# EAGLE design vdmotCtrl_v1 (EAGLE 9.5.2)
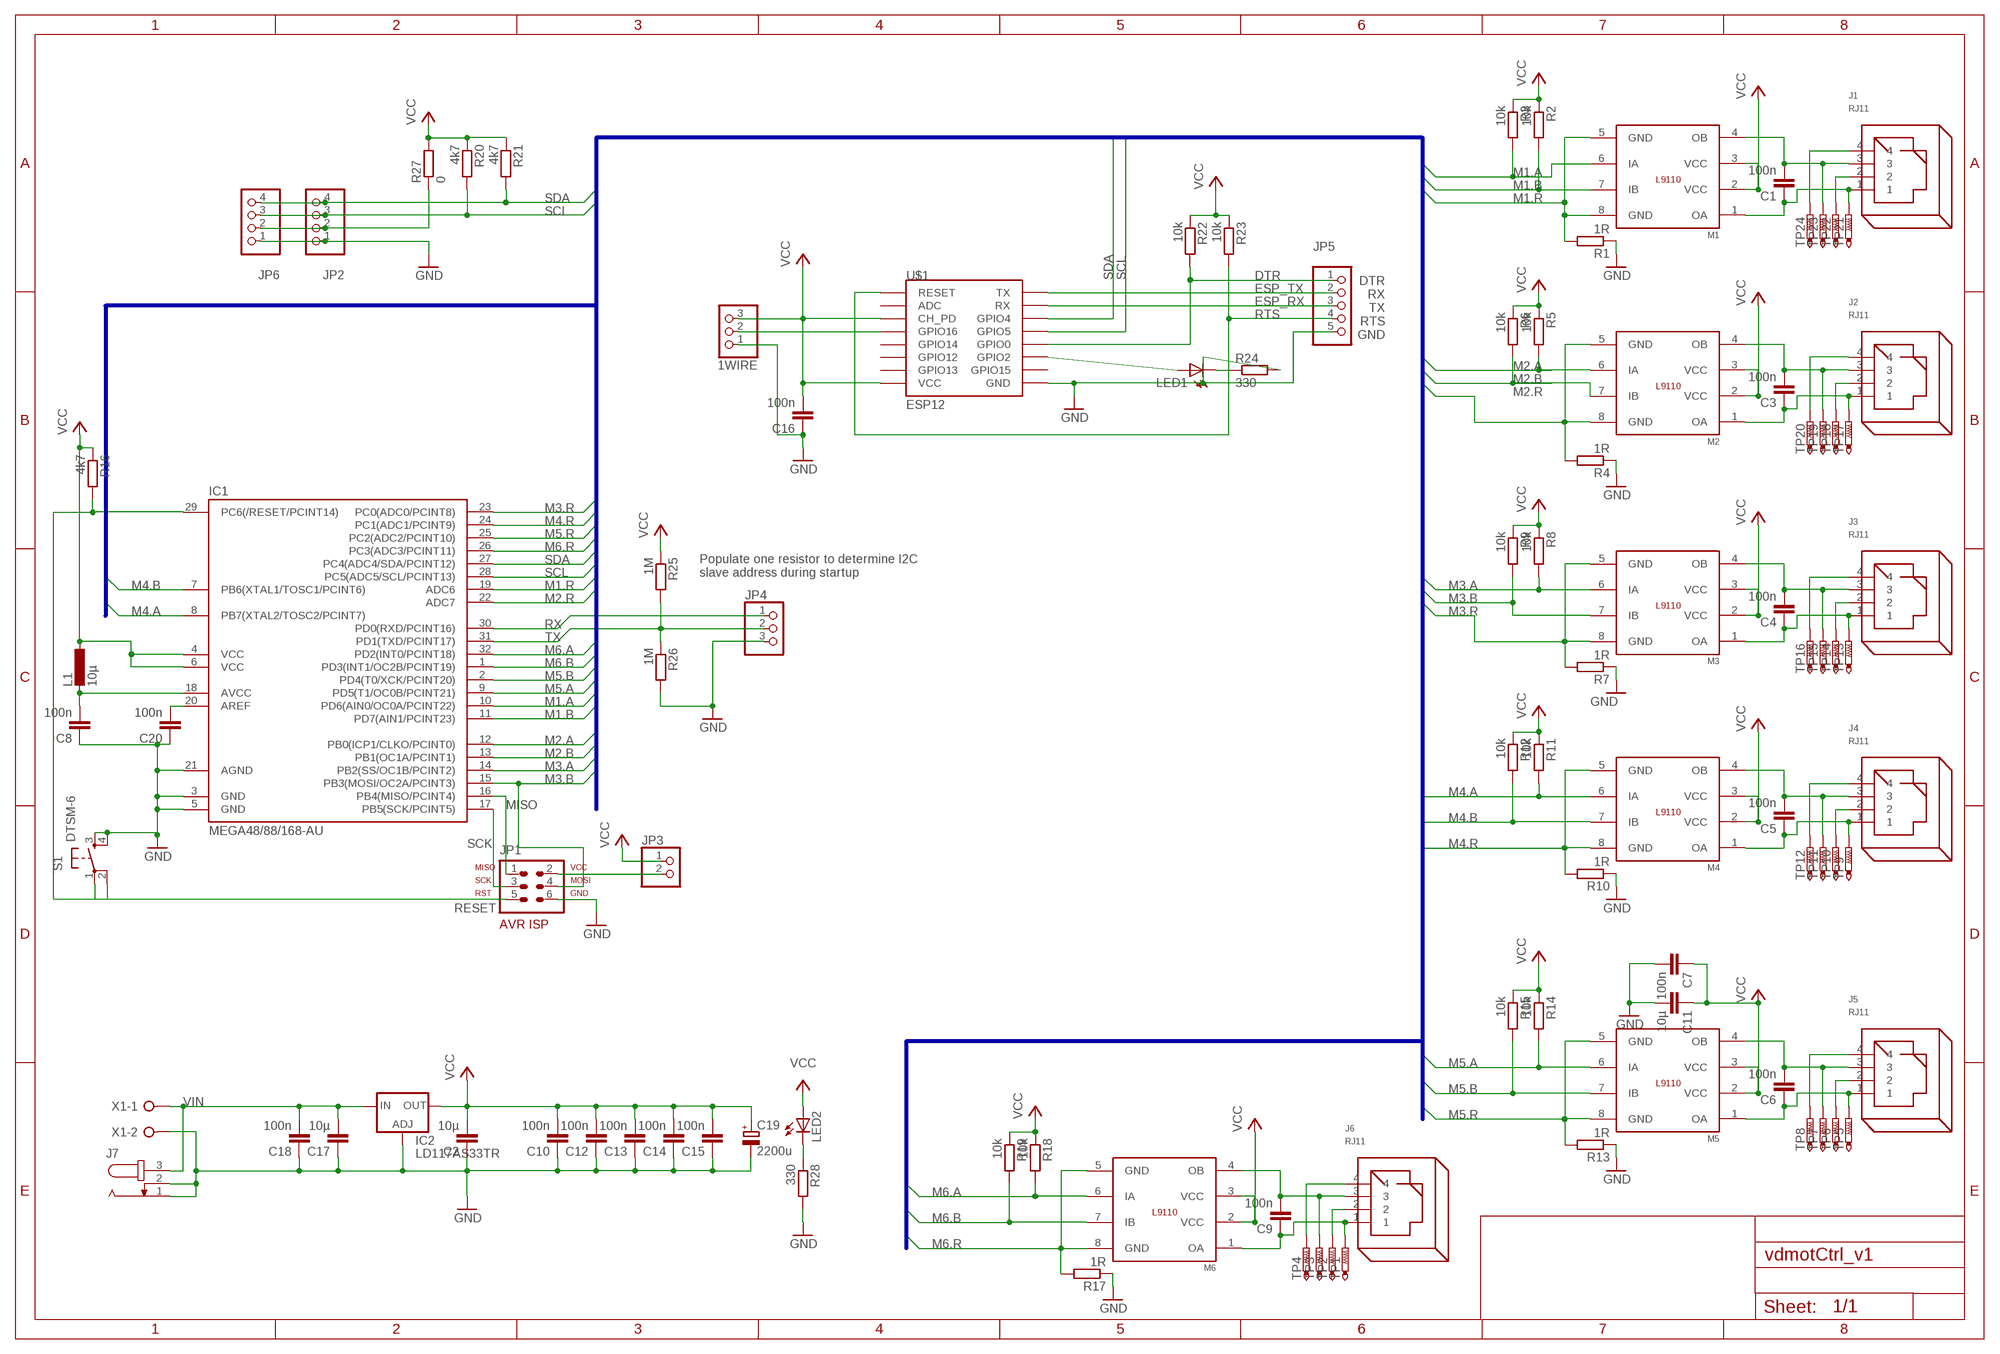
[diagram p0: schematic, sheet 1]

## Parts
1WIRE  PINHD-1X3  [1X03]
C1  100n  C-EUC0805  [C0805]
C2  10µ  C-EUC0805  [C0805]
C3  100n  C-EUC0805  [C0805]
C4  100n  C-EUC0805  [C0805]
C5  100n  C-EUC0805  [C0805]
C6  100n  C-EUC0805  [C0805]
C7  100n  C-EUC0805  [C0805]
C8  100n  C-EUC0805  [C0805]
C9  100n  C-EUC0805  [C0805]
C10  100n  C-EUC0805  [C0805]
C11  10µ  C-EUC0805  [C0805]
C12  100n  C-EUC0805  [C0805]
C13  100n  C-EUC0805  [C0805]
C14  100n  C-EUC0805  [C0805]
C15  100n  C-EUC0805  [C0805]
C16  100n  C-EUC0805  [C0805]
C17  10µ  C-EUC0805  [C0805]
C18  100n  C-EUC0805  [C0805]
C19  2200u  CPOL-EUE5-10.5  [E5-10,5]
C20  100n  C-EUC0805  [C0805]
IC1  MEGA48/88/168-AU  [TQFP32-08]
IC2  LD117AS33TR  [SOT223]
J1  RJ11  [RJ11]
J2  RJ11  [RJ11]
J3  RJ11  [RJ11]
J4  RJ11  [RJ11]
J5  RJ11  [RJ11]
J6  RJ11  [RJ11]
J7  JACK-PLUG0  [SPC4077]
JP1  AVR-ISP-6VERT  [AVR-ISP-6]
JP2  PINHD-1X4  [1X04]
JP3  PINHD-1X2  [1X02]
JP4  PINHD-1X3  [1X03]
JP5  PINHD-1X5  [1X05]
JP6  PINHD-1X4  [1X04]
L1  10µ  L-EU0204/7  [0204/7]
LED1  RED  LEDSML0805  [SML0805]
LED2  RED  LEDSML0805  [SML0805]
M1  L9110  [SO8P]
M2  L9110  [SO8P]
M3  L9110  [SO8P]
M4  L9110  [SO8P]
M5  L9110  [SO8P]
M6  L9110  [SO8P]
R1  1R  R-EU_R0805  [R0805]
R2  10k  R-EU_R0805  [R0805]
R3  10k  R-EU_R0805  [R0805]
R4  1R  R-EU_R0805  [R0805]
R5  10k  R-EU_R0805  [R0805]
R6  10k  R-EU_R0805  [R0805]
R7  1R  R-EU_R0805  [R0805]
R8  10k  R-EU_R0805  [R0805]
R9  10k  R-EU_R0805  [R0805]
R10  1R  R-EU_R0805  [R0805]
R11  10k  R-EU_R0805  [R0805]
R12  10k  R-EU_R0805  [R0805]
R13  1R  R-EU_R0805  [R0805]
R14  10k  R-EU_R0805  [R0805]
R15  10k  R-EU_R0805  [R0805]
R16  4k7  R-EU_R0805  [R0805]
R17  1R  R-EU_R0805  [R0805]
R18  10k  R-EU_R0805  [R0805]
R19  10k  R-EU_R0805  [R0805]
R20  4k7  R-EU_R0805  [R0805]
R21  4k7  R-EU_R0805  [R0805]
R22  10k  R-EU_R0805  [R0805]
R23  10k  R-EU_R0805  [R0805]
R24  330  R-EU_R0805  [R0805]
R25  1M  R-EU_R0805  [R0805]
R26  1M  R-EU_R0805  [R0805]
R27  0  R-EU_M0805  [M0805]
R28  330  R-EU_R0805  [R0805]
S1  DTSM-6  [DTSM-6]
TP1  PTR1TP15SQ  [TP15SQ]
TP2  PTR1TP15SQ  [TP15SQ]
TP3  PTR1TP15SQ  [TP15SQ]
TP4  PTR1TP15SQ  [TP15SQ]
TP5  PTR1TP15SQ  [TP15SQ]
TP6  PTR1TP15SQ  [TP15SQ]
TP7  PTR1TP15SQ  [TP15SQ]
TP8  PTR1TP15SQ  [TP15SQ]
TP9  PTR1TP15SQ  [TP15SQ]
TP10  PTR1TP15SQ  [TP15SQ]
TP11  PTR1TP15SQ  [TP15SQ]
TP12  PTR1TP15SQ  [TP15SQ]
TP13  PTR1TP15SQ  [TP15SQ]
TP14  PTR1TP15SQ  [TP15SQ]
TP15  PTR1TP15SQ  [TP15SQ]
TP16  PTR1TP15SQ  [TP15SQ]
TP17  PTR1TP15SQ  [TP15SQ]
TP18  PTR1TP15SQ  [TP15SQ]
TP19  PTR1TP15SQ  [TP15SQ]
TP20  PTR1TP15SQ  [TP15SQ]
TP21  PTR1TP15SQ  [TP15SQ]
TP22  PTR1TP15SQ  [TP15SQ]
TP23  PTR1TP15SQ  [TP15SQ]
TP24  PTR1TP15SQ  [TP15SQ]
U$1  ESP12  [ESP12]
X1  W237-02P  [W237-132]

## Nets
DTR: JP5.1 R22.2 U$1.GPIO0
ESP_RX: JP5.3 U$1.RX
ESP_TX: JP5.2 U$1.TX
GND: 1WIRE.1 C2.1 C7.2 C8.1 C10.1 C11.2 C12.1 C13.1 C14.1 C15.1 C16.1 C17.1 C18.1 C19.- C20.1 IC1.3(GND) IC1.5(GND) IC1.21(AGND) IC2.1(ADJ) J7.1 J7.2 JP1.6 JP2.1 JP4.3 JP5.5 JP6.1 R1.1 R4.1 R7.1 R10.1 R13.1 R17.1 R24.2 R26.2 R28.2 S1.3 S1.4 U$1.GND X1.2
M1.A: IC1.10(PD6(AIN0/OC0A/PCINT22)) M1.6(IA) R3.2
M1.B: IC1.11(PD7(AIN1/PCINT23)) M1.7(IB) R2.2
M1.R: IC1.19(ADC6) M1.5(GND) M1.8(GND) R1.2
M2.A: IC1.12(PB0(ICP1/CLKO/PCINT0)) M2.6(IA) R5.2
M2.B: IC1.13(PB1(OC1A/PCINT1)) M2.7(IB) R6.2
M2.R: IC1.22(ADC7) M2.5(GND) M2.8(GND) R4.2
M3.A: IC1.14(PB2(SS/OC1B/PCINT2)) M3.6(IA) R8.2
M3.B: IC1.15(PB3(MOSI/OC2A/PCINT3)) JP1.4 M3.7(IB) R9.2
M3.R: IC1.23(PC0(ADC0/PCINT8)) M3.5(GND) M3.8(GND) R7.2
M4.A: IC1.8(PB7(XTAL2/TOSC2/PCINT7)) M4.6(IA) R11.2
M4.B: IC1.7(PB6(XTAL1/TOSC1/PCINT6)) M4.7(IB) R12.2
M4.R: IC1.24(PC1(ADC1/PCINT9)) M4.5(GND) M4.8(GND) R10.2
M5.A: IC1.9(PD5(T1/OC0B/PCINT21)) M5.6(IA) R14.2
M5.B: IC1.2(PD4(T0/XCK/PCINT20)) M5.7(IB) R15.2
M5.R: IC1.25(PC2(ADC2/PCINT10)) M5.5(GND) M5.8(GND) R13.2
M6.A: IC1.32(PD2(INT0/PCINT18)) M6.6(IA) R18.2
M6.B: IC1.1(PD3(INT1/OC2B/PCINT19)) M6.7(IB) R19.2
M6.R: IC1.26(PC3(ADC3/PCINT11)) M6.5(GND) M6.8(GND) R17.2
MISO: IC1.16(PB4(MISO/PCINT4)) JP1.1
N$1: C1.1 J1.1 M1.1(OA) TP21.TP
N$2: C1.2 J1.3 M1.4(OB) TP23.TP
N$3: C3.1 J2.1 M2.1(OA) TP17.TP
N$4: C3.2 J2.3 M2.4(OB) TP19.TP
N$5: C4.1 J3.1 M3.1(OA) TP13.TP
N$6: C4.2 J3.3 M3.4(OB) TP15.TP
N$7: C5.1 J4.1 M4.1(OA) TP9.TP
N$8: C5.2 J4.3 M4.4(OB) TP11.TP
N$9: C6.1 J5.1 M5.1(OA) TP5.TP
N$10: C6.2 J5.3 M5.4(OB) TP7.TP
N$11: C20.2 IC1.20(AREF)
N$12: C8.2 IC1.18(AVCC) L1.2
N$13: J6.2 TP2.TP
N$14: LED1.A U$1.GPIO2
N$15: C9.1 J6.1 M6.1(OA) TP1.TP
N$16: C9.2 J6.3 M6.4(OB) TP3.TP
N$17: LED1.C R24.1
N$18: J6.4 TP4.TP
N$19: J1.2 TP22.TP
N$20: J1.4 TP24.TP
N$21: JP1.2 JP3.2
N$22: J2.2 TP18.TP
N$23: J2.4 TP20.TP
N$24: J3.4 TP16.TP
N$25: J3.2 TP14.TP
N$26: J4.4 TP12.TP
N$27: J4.2 TP10.TP
N$28: J5.4 TP8.TP
N$29: J5.2 TP6.TP
N$30: JP2.2 JP6.2 R27.1
N$31: 1WIRE.2 U$1.GPIO16
N$32: LED2.C R28.1
RESET: IC1.29(PC6(/RESET/PCINT14)) JP1.5 R16.2 S1.1 S1.2
RTS: JP5.4 R23.2 U$1.RESET
RX: IC1.30(PD0(RXD/PCINT16)) JP4.1
SCK: IC1.17(PB5(SCK/PCINT5)) JP1.3
SCL: IC1.28(PC5(ADC5/SCL/PCINT13)) JP2.3 JP6.3 R20.2 U$1.GPIO5
SDA: IC1.27(PC4(ADC4/SDA/PCINT12)) JP2.4 JP6.4 R21.2 U$1.GPIO4
TX: IC1.31(PD1(TXD/PCINT17)) JP4.2 R25.2 R26.1
VCC: 1WIRE.3 C2.2 C7.1 C10.2 C11.1 C12.2 C13.2 C14.2 C15.2 C16.2 C19.+ IC1.4(VCC) IC1.6(VCC) IC2.4(OUT) JP3.1 L1.1 LED2.A M1.2(VCC) M1.3(VCC) M2.2(VCC) M2.3(VCC) M3.2(VCC) M3.3(VCC) M4.2(VCC) M4.3(VCC) M5.2(VCC) M5.3(VCC) M6.2(VCC) M6.3(VCC) R2.1 R3.1 R5.1 R6.1 R8.1 R9.1 R11.1 R12.1 R14.1 R15.1 R16.1 R18.1 R19.1 R20.1 R21.1 R22.1 R23.1 R25.1 R27.2 U$1.CH_PD U$1.VCC
VIN: C17.2 C18.2 IC2.3(IN) J7.3 X1.1
Unconnected: U$1.ADC U$1.GPIO12 U$1.GPIO13 U$1.GPIO14 U$1.GPIO15

## Buses
M1.A,M1.B,M1.R,M2.A,M2.B,M2.R,M3.A,M3.B,M3.R,M4.A,M4.B,M4.R,M5.A,M5.B,M5.R,M6.A,M6.B,M6.R,SCL,SDA

## Notes on the sheet
- DTR
  RX
  TX
  RTS
  GND
- Populate one resistor to determine I2C
  slave address during startup

## Library data of the parts
1WIRE JP4 = pinhead:PINHD-1X3: PIN HEADER
C1-C18 C20 = rcl:C-EU: CAPACITOR, European symbol; SPICEPREFIX: C
C19 = rcl:CPOL-EU: POLARIZED CAPACITOR, European symbol; SPICEPREFIX: C
IC1 = avr-7:MEGA48/88/168
IC2 = v-reg:LD117A?*: Low drop fixed and adjustable positive voltage regulators 1 A Source: http://www.st.com/stonline/products/literature/ds/7194/ld1117axx.pdf
J1-J6 = con-rj:RJ11: RJ11, RJ22 RJ11 and RJ22 jacks side mounted http://www.tycoelectronics.com
J7 = con-jack:JACK-PLUG: DC POWER JACK Power Jack, DC, Right Angle, Through Hole, Rated 5A at 16VDC, PC Terminals Distributor: Farnell (www.Farnell.de) Drawing: 84N1161.pdf / 84N1162.pdf Manufacturer: SPC Technology (www.spctechnology.com) Type: SPC4077 / SPC 4078; OC_FARNELL: unknown; OC_NEWARK: unknown
JP1 = avr-7:AVR-ISP-6: AVR ISP-6 Serial Programming Header
JP2 JP6 = pinhead:PINHD-1X4: PIN HEADER
JP3 = pinhead:PINHD-1X2: PIN HEADER
JP5 = pinhead:PINHD-1X5: PIN HEADER
L1 = rcl:L-EU: INDUCTOR, European symbol; SPICEPREFIX: L
LED1 LED2 = led:LED: LED OSRAM: - CHIPLED LG R971, LG N971, LY N971, LG Q971, LY Q971, LO R971, LY R971 LH N974, LH R974 LS Q976, LO Q976, LY Q976 LO Q996 - Hyper CHIPLED LW Q18S LB Q993, LB Q99A, LB R99A - SideLED LS A670, LO A670, LY A670, LG A670, LP A670 LB A673, LV A673, LT A673, LW A673 LH A674 LY A675 LS A676, LA A676, LO A676, LY A676, LW A676 LS A679, LY A679, LG A679 - Hyper Micro SIDELED® LS Y876, LA Y876, LO Y876, LY Y876 LT Y87S - SmartLED LW L88C, LW L88S LB L89C, LB L89S, LG L890 LS L89K, LO L89K, LY L89K LS L896, LA L896, LO L896, LY L896 - TOPLED LS T670, LO T670, LY T670, LG T670, LP T670 LSG T670, LSP T670, LSY T670, LOP T670, LYG T670 LG T671, LOG T671, LSG T671 LB T673, LV T673, LT T673, LW T673 LH T674 LS T676, LA T676, LO T676, LY T676, LB T676, LH T676, LSB T676, LW T676 LB T67C, LV T67C, LT T67C, LS T67K, LO T67K, LY T67K, LW E67C LS E67B, LA E67B, LO E67B, LY E67B, LB E67C, LV E67C, LT E67C LW T67C LS T679, LY T679, LG T679 LS T770, LO T770, LY T770, LG T770, LP T770 LB T773, LV T773, LT T773, LW T773 LH T774 LS E675, LA E675, LY E675, LS T675 LS T776, LA T776, LO T776, LY T776, LB T776 LHGB T686 LT T68C, LB T68C - Hyper Mini TOPLED® LB M676 - Mini TOPLED Santana® LG M470 LS M47K, LO M47K, LY M47K Source: http://www.osram.convergy.de LUXEON: - LUMILED® LXK2-PW12-R00, LXK2-PW12-S00, LXK2-PW14-U00, LXK2-PW14-V00 LXK2-PM12-R00, LXK2-PM12-S00, LXK2-PM14-U00 LXK2-PE12-Q00, LXK2-PE12-R00, LXK2-PE12-S00, LXK2-PE14-T00, LXK2-PE14-U00 LXK2-PB12-K00, LXK2-PB12-L00, LXK2-PB12-M00, LXK2-PB14-N00, LXK2-PB14-P00, LXK2-PB14-Q00 LXK2-PR12-L00, LXK2-PR12-M00, LXK2-PR14-Q00, LXK2-PR14-R00 LXK2-PD12-Q00, LXK2-PD12-R00, LXK2-PD12-S00 LXK2-PH12-R00, LXK2-PH12-S00 LXK2-PL12-P00, LXK2-PL12-Q00, LXK2-PL12-R00 Source: www.luxeon.com KINGBRIGHT: KA-3528ASYC Source: www.kingbright.com
M1-M6 = FaBo-Motor:L9110
R1-R28 = rcl:R-EU_: RESISTOR, European symbol; SPICEPREFIX: R
S1 = switch-tact:DTSM-6
TP1-TP24 = testpad:PTR1: TEST PIN
U$1 = esp8266modules:ESP12: ESP8266 Wifi module 12
X1 = con-wago-508:W237-02P: WAGO SREW CLAMP; OC_FARNELL: unknown; OC_NEWARK: unknown

## Board
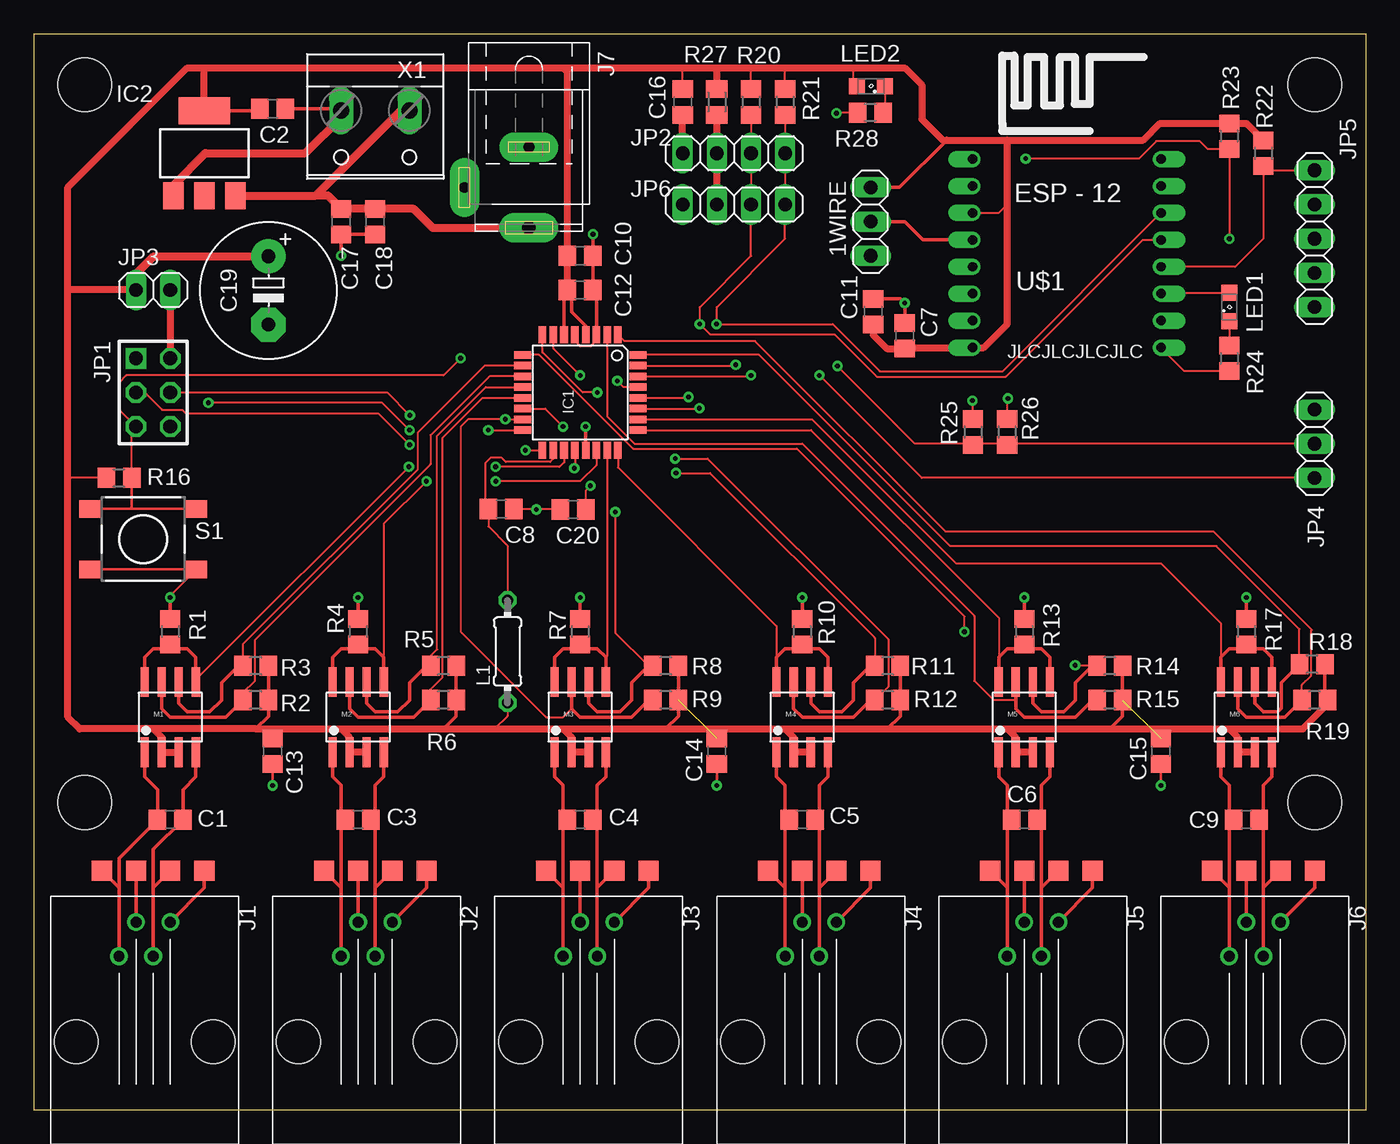
[diagram p1: board, top side]
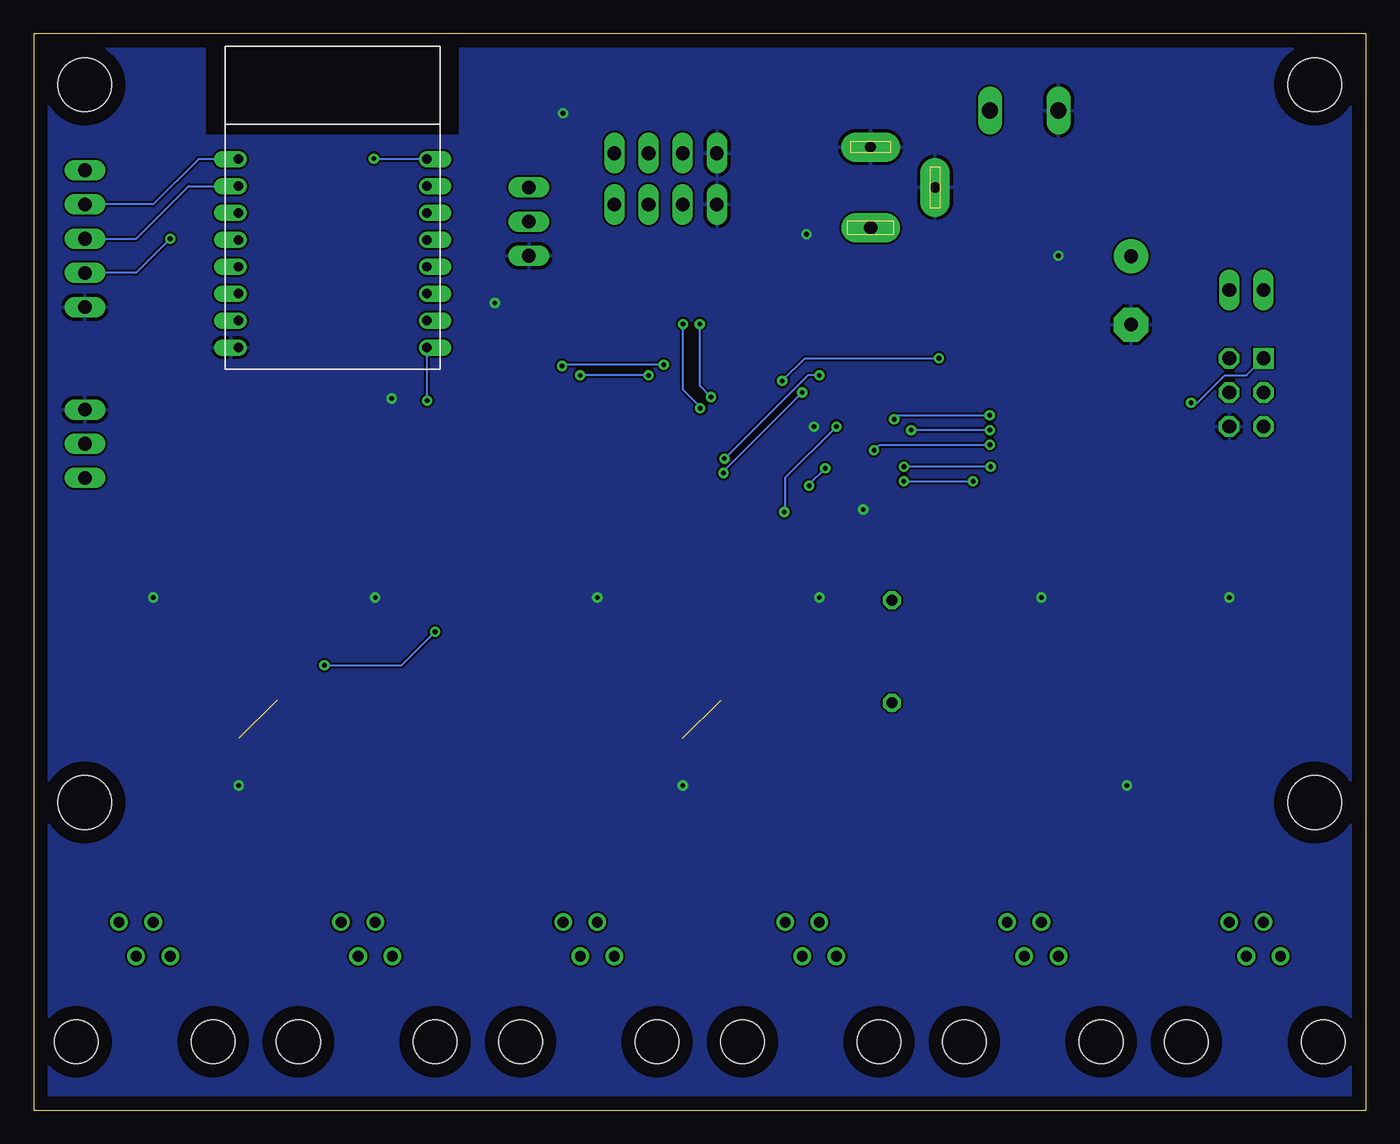
[diagram p2: board, bottom side, seen from below]

Size 99.06 x 80.01 mm. Coordinates in mm from the lower left corner, seen from the top.
Outline: 0,80 0,0 99.06,0 99.06,80.01 0,80.01
Copper layers (1*16): Top 0.035mm / dielectric 1.5mm / Bottom 0.035mm
Design rules "default": minimum track width 6mil, minimum drill 0.35mm, track to track 6mil, track to pad 6mil, pad to pad 6mil, via to via 6mil, smd to smd 6mil, copper to edge 40mil, drill to drill 6mil, minimum pad ring 10mil, minimum via ring 8mil, stop-mask expansion 4mil, vias tented up to drill 0mil, thermal gap 10mil
Holes 4 mm at 95.25,22.86 95.25,76.2 3.81,76.2 3.81,22.86

### Footprints (pad centres in the part's own frame; a part is rotated, then mirrored left to right if it is on the bottom)
1X03 = drill 1.016 long: 1 -2.54,0; 2 0,0; 3 2.54,0
C0805 = smd 1.3 x 1.5: 1 -0.95,0; 2 0.95,0
E5-10,5 = drill 1.016 pad 2.54: + -2.54,0 | drill 1.016 pad 2.54 octagon: - 2.54,0
TQFP32-08 = smd 1.27 x 0.559: 1 -4.293,2.8; 2 -4.293,2; 3 -4.293,1.2; 4 -4.293,0.4; 5 -4.293,-0.4; 6 -4.293,-1.2; 7 -4.293,-2; 8 -4.293,-2.8; 17 4.293,-2.8; 18 4.293,-2; 19 4.293,-1.2; 20 4.293,-0.4; 21 4.293,0.4; 22 4.293,1.2; 23 4.293,2; 24 4.293,2.8 | smd 0.559 x 1.27: 9 -2.8,-4.293; 10 -2,-4.293; 11 -1.2,-4.293; 12 -0.4,-4.293; 13 0.4,-4.293; 14 1.2,-4.293; 15 2,-4.293; 16 2.8,-4.293; 25 2.8,4.293; 26 2,4.293; 27 1.2,4.293; 28 0.4,4.293; 29 -0.4,4.293; 30 -1.2,4.293; 31 -2,4.293; 32 -2.8,4.293
SOT223 = smd 1.5 x 2: 1 -2.3,-3.15; 2 0,-3.15; 3 2.3,-3.15 | smd 3.8 x 2: 4 0,3.15
RJ11 = drill 0.8: 1 -3.81,-2.54; 2 -6.35,-1.27; 3 -3.81,0; 4 -6.35,1.27 | hole 3.25: 2.54,-5.715; 2.54,4.445
SPC4077 = drill 0.8 pad 2.184 long: 1 -3,0; 2 0,-4.8 | drill 1 pad 2.184 long: 3 3,0
AVR-ISP-6 = drill 1.016 square: 1 -2.54,-1.27 | drill 1.016 octagon: 2 -2.54,1.27; 3 0,-1.27; 4 0,1.27; 5 2.54,-1.27; 6 2.54,1.27
1X04 = drill 1.016 long: 1 -3.81,0; 2 -1.27,0; 3 1.27,0; 4 3.81,0
1X02 = drill 1.016 long: 1 -1.27,0; 2 1.27,0
1X05 = drill 1.016 long: 1 -5.08,0; 2 -2.54,0; 3 0,0; 4 2.54,0; 5 5.08,0
0204/7 = drill 0.813 octagon: 1 -3.81,0; 2 3.81,0
SML0805 = smd 1.2 x 1.2: A 1.05,0; C -1.05,0
SO8P = smd 0.61 x 2.21: 1 -1.905,-2.616; 2 -0.635,-2.616; 3 0.635,-2.616; 4 1.905,-2.616; 5 1.905,2.616; 6 0.635,2.616; 7 -0.635,2.616; 8 -1.905,2.616
R0805 = smd 1.3 x 1.5: 1 -0.95,0; 2 0.95,0
M0805 = smd 1.3 x 1.6: 1 -0.95,0; 2 0.95,0
DTSM-6 = smd 1.55 x 1.3: 1 -3.975,2.25; 2 3.975,2.25; 3 -3.975,-2.25; 4 3.975,-2.25
TP15SQ = smd 1.5 x 1.5: TP 0,0
ESP12 = drill 0.7 offset: ADC -7.1,3.8; CH_PD -7.1,1.8; GND 6.9,-8.2; GPIO0 6.9,-2.2; GPIO2 6.9,-4.2; GPIO4 6.9,1.8; GPIO5 6.9,-0.2; GPIO12 -7.1,-4.2; GPIO13 -7.1,-6.2; GPIO14 -7.1,-2.2; GPIO15 6.9,-6.2; GPIO16 -7.1,-0.2; RESET -7.1,5.8; RX 6.9,3.8; TX 6.9,5.8; VCC -7.1,-8.2
W237-132 = drill 1.194 long: 1 -2.54,-0.635; 2 2.54,-0.635

### Placement (x,y rotation side)
1WIRE  62.23,66.04 90 top
C1  10.16,21.59 0 top
C2  17.78,74.43 180 top
C3  24.13,21.59 0 top
C4  40.64,21.59 0 top
C5  57.15,21.59 0 top
C6  73.66,21.59 0 top
C7  64.77,57.55 90 top
C8  34.77,44.68 180 top
C9  90.17,21.59 0 top
C10  40.64,63.5 180 top
C11  62.43,59.35 90 top
C12  40.64,60.96 180 top
C13  17.78,26.67 90 top
C14  50.8,26.67 90 top
C15  83.82,26.67 90 top
C16  48.26,74.93 90 top
C17  22.86,66.04 90 top
C18  25.4,66.04 90 top
C19  17.46,60.92 270 top
C20  40.1,44.64 0 top
IC1  40.64,53.34 270 top
IC2  12.7,71.12 0 top
J1  8.89,7.62 270 top
J2  25.4,7.62 270 top
J3  41.91,7.62 270 top
J4  58.42,7.62 270 top
J5  74.93,7.62 270 top
J6  91.44,7.62 270 top
J7  36.83,68.58 270 top
JP1  8.89,53.34 270 top
JP2  52.07,71.12 0 top
JP3  8.89,60.96 0 top
JP4  95.25,49.53 90 top
JP5  95.25,64.77 270 top
JP6  52.07,67.31 0 top
L1  35.24,34.08 90 top
LED1  88.9,59.69 90 top
LED2  62.26,76.1 180 top
M1  10.16,29.21 0 top
M2  24.13,29.21 0 top
M3  40.64,29.21 0 top
M4  57.15,29.21 0 top
M5  73.66,29.21 0 top
M6  90.17,29.21 0 top
R1  10.16,35.56 270 top
R2  16.51,30.48 180 top
R3  16.51,33.02 180 top
R4  24.13,35.56 270 top
R5  30.48,33.02 180 top
R6  30.48,30.48 180 top
R7  40.64,35.56 270 top
R8  46.99,33.02 180 top
R9  46.99,30.48 180 top
R10  57.15,35.56 270 top
R11  63.5,33.02 180 top
R12  63.5,30.48 180 top
R13  73.66,35.56 270 top
R14  80.01,33.02 180 top
R15  80.01,30.48 180 top
R16  6.35,46.99 0 top
R17  90.17,35.56 270 top
R18  95.07,33.14 180 top
R19  95.25,30.48 180 top
R20  53.34,74.93 270 top
R21  55.88,74.93 270 top
R22  91.44,71.12 270 top
R23  88.9,72.39 270 top
R24  88.9,55.88 270 top
R25  69.85,50.4 270 top
R26  72.39,50.4 90 top
R27  50.8,74.93 90 top
R28  62.22,74.14 180 top
S1  8.15,42.44 0 top
TP1  87.63,17.78 0 top
TP2  90.17,17.78 0 top
TP3  92.71,17.78 0 top
TP4  95.25,17.78 0 top
TP5  71.12,17.78 0 top
TP6  73.66,17.78 0 top
TP7  76.2,17.78 0 top
TP8  78.74,17.78 0 top
TP9  54.61,17.78 0 top
TP10  57.15,17.78 0 top
TP11  59.69,17.78 0 top
TP12  62.23,17.78 0 top
TP13  38.1,17.78 0 top
TP14  40.64,17.78 0 top
TP15  43.18,17.78 0 top
TP16  45.72,17.78 0 top
TP17  21.59,17.78 0 top
TP18  24.13,17.78 0 top
TP19  26.67,17.78 0 top
TP20  29.21,17.78 0 top
TP21  5.08,17.78 0 top
TP22  7.62,17.78 0 top
TP23  10.16,17.78 0 top
TP24  12.7,17.78 0 top
U$1  76.92,64.88 0 top
X1  25.4,73.66 180 top

### Tracks (layer width: path | path; a pad name or v marks a point on that pad's centre or on a via)
DTR
  Top 0.152: U$1.GPIO0 89.35,62.68 91.44,64.77 R22.2 91.76,69.85 JP5.1
ESP_RX
  Bottom 0.152: JP5.3 91.44,64.77 87.53,68.68 U$1.RX
ESP_TX
  Bottom 0.152: U$1.TX 86.8,70.68 90.17,67.31 JP5.2
GND  (via drill 0.35)
  Top 0.152: IC1.3 41.85,57.2 41.41,56.77 40.67,56.77 40.23,57.2 IC1.5 | v41.59,65.09 v41.6,65.1 | R24.2 85.57,54.93 U$1.GND | C8.1 35.76,44.64 v37.38,44.64 C20.1 | R26.2 72.39,52.84 v72.44,52.89 | R28.2 59.74,74.14 v59.7,74.1
  Top 0.203: C13.1 v17.78,24.13 | C14.1 v50.8,24.13 | C15.1 v83.82,24.13 | S1.3 S1.4 10.16,38.23 v10.16,38.1
  Top 0.254: R1.1 v10.16,38.1 | v90.17,38.1 R17.1 | v73.66,38.1 R13.1 | v57.15,38.1 R10.1 | v40.64,38.1 R7.1 | v24.13,38.1 R4.1 | IC1.3 41.84,60.71 C12.1 C10.1 v41.59,65.09 | v41.04,50.8 IC1.21 | v22.86,63.5 C17.1 C18.1 | C11.2 64.46,60.3 v64.77,59.99 C7.2 | C2.1 22.73,74.43 X1.2
  Top 0.508: JP2.1 C16.1
  Top 0.61: IC2.1 10.4,68.75 12.77,71.12 20.21,71.12 22.86,73.77 X1.2
  pour Bottom: 0,0 99.06,0 99.06,80.01 86.36,80.01 86.36,72.39 67.31,72.39 67.31,80.01 0,80.01
M1.A
  Top 0.152: R3.2 15.56,34.29 15.56,34.53 15.56,34.61 28.56,47.6 28.56,50.36 33.52,55.32 36.35,55.32 IC1.10
  Top 0.254: M1.6 10.79,30.25 11.43,29.62 13.11,29.62 13.97,30.48 13.97,31.75 15.24,33.02 R3.2
M1.B
  Top 0.152: R2.2 15.56,31 16.44,31.88 16.44,34.94 29.51,48.01 29.51,50.16 33.89,54.54 36.04,54.54 IC1.11
  Top 0.254: R2.2 14.29,29.21 10.16,29.21 9.53,29.84 M1.7
M1.R  (via drill 0.35)
  Top 0.152: M1.5 12.06,31.97 v27.9,47.81 | v34.35,47.81 39.1,47.81 39.44,48.15 IC1.19
  Top 0.254: M1.8 8.26,33.66 8.89,34.29 10.16,34.29 | 10.16,34.29 11.43,34.29 12.06,33.66 M1.5 | R1.2 10.16,34.29
  Bottom 0.152: v27.9,47.81 v34.35,47.81
M2.A
  Top 0.152: R5.2 29.53,33.75 30.02,34.24 30.02,50.14 33.62,53.74 IC1.12
  Top 0.254: M2.6 24.77,30.25 25.4,29.62 27.08,29.62 27.94,30.48 27.94,31.75 29.21,33.02 R5.2
M2.B
  Top 0.152: R6.2 29.53,31.3 30.41,32.17 30.41,49.96 33.39,52.94 IC1.13
  Top 0.254: M2.7 23.5,29.84 24.13,29.21 28.26,29.21 R6.2
M2.R  (via drill 0.35)
  Top 0.152: IC1.22 41.84,47.94 40.64,46.74 v34.36,46.74 | v29.21,46.74 26.04,43.56 26.04,33.66
  Top 0.254: M2.8 22.23,33.66 22.86,34.29 23.81,34.29 23.97,34.45 | R4.2 23.97,34.45 | M2.5 26.04,33.66 25.4,34.29 24.13,34.29 23.97,34.45
  Bottom 0.152: v34.36,46.74 v29.21,46.74
M3.A  (via drill 0.35)
  Top 0.152: IC1.14 38.03,52.14 v39.37,50.8 | v43.25,44.45 43.25,35.49 45.72,33.02
  Top 0.254: M3.6 41.27,30.25 41.91,29.62 43.59,29.62 44.45,30.48 44.45,31.75 45.72,33.02 R8.2
  Bottom 0.152: v39.37,50.8 43.18,46.99 43.18,44.45 v43.25,44.45
M3.B  (via drill 0.35)
  Top 0.152: JP1.4 26.27,53.34 v27.97,51.64 | IC1.15 v35.08,51.34 32.29,51.34 31.75,50.8 31.75,35.56 38.1,29.21 39.37,29.21 40.01,29.84
  Top 0.254: M3.7 40.01,29.84 40.64,29.21 44.45,29.21 45.72,30.48 R9.2
  Bottom 0.152: v35.08,51.34 34.78,51.64 v27.97,51.64
M3.R
  Top 0.152: IC1.23 42.64,33.75 42.55,33.66
  Top 0.254: M3.8 38.73,33.66 39.37,34.29 40.64,34.29 R7.2 40.96,34.29 41.91,34.29 42.55,33.66 M3.5
M4.A  (via drill 0.35)
  Top 0.152: v41.91,53.34 40.82,53.34 37.84,56.32 IC1.8 | R11.2 62.55,35.1 50.3,47.35 v47.76,47.35
  Top 0.254: M4.6 57.78,30.25 58.42,29.62 60.1,29.62 60.96,30.48 60.96,31.75 62.23,33.02 R11.2
  Bottom 0.152: v41.91,53.34 47.76,47.49 v47.76,47.35
M4.B  (via drill 0.35)
  Top 0.152: R12.2 63.55,31.48 63.55,34.98 50.11,48.42 v47.7,48.42 | IC1.7 38.64,56.61 v40.64,54.61
  Top 0.254: M4.7 56.52,29.84 57.15,29.21 60.96,29.21 62.23,30.48 R12.2
  Bottom 0.152: v47.7,48.42 v47.69,48.41 41.5,54.61 v40.64,54.61
M4.R
  Top 0.152: IC1.24 43.44,47.78 55.24,35.97 55.24,33.02
  Top 0.254: M4.8 55.24,33.02 55.24,33.66 55.88,34.29 56.83,34.29 R10.2 57.47,34.29 58.42,34.29 59.05,33.66 M4.5
M5.A  (via drill 0.35)
  Top 0.152: IC1.9 37.58,56.15 44.57,49.16 56.76,49.16 69.21,36.7 v69.21,35.56 | R14.2 77.48,33.02 v77.44,33.06
  Top 0.254: M5.6 74.3,30.25 74.93,29.62 76.61,29.62 77.47,30.48 77.47,31.75 78.74,33.02 R14.2
  Bottom 0.152: v77.44,33.06 71.71,33.06 v69.21,35.56
M5.B
  Top 0.152: IC1.2 42.64,51.56 44.67,49.53 57.15,49.53 69.95,36.73 69.95,31.9 71.36,30.49 73.01,30.49 73.03,30.48
  Top 0.254: M5.7 73.03,30.48 73.03,29.84 73.66,29.21 77.47,29.21 78.74,30.48 R15.2
M5.R
  Top 0.152: IC1.25 57.81,50.54 71.75,36.59 71.75,33.02
  Top 0.254: M5.8 71.75,33.02 71.75,33.66 72.39,34.29 73.34,34.29 R13.2 73.98,34.29 74.93,34.29 75.56,33.66 M5.5
M6.A
  Top 0.152: IC1.32 53.92,56.14 68.15,41.91 87.95,41.91 94.12,35.74 R18.2
  Top 0.254: M6.6 90.81,30.25 91.44,29.62 92.52,29.62 92.78,29.88 92.78,31.75 94.12,33.09 R18.2
M6.B
  Top 0.152: IC1.1 43.92,57.15 53.65,57.15 67.78,43.02 87.72,43.02 95.05,35.69 95,35.64 95,32.3 94.3,31.6 R19.2
  Top 0.254: M6.7 89.53,29.84 90.17,29.21 93.03,29.21 R19.2
M6.R
  Top 0.152: IC1.26 57.88,51.34 68.58,40.64 83.82,40.64 88.27,36.2 88.27,33.02
  Top 0.254: M6.8 88.27,33.02 88.27,33.66 88.9,34.29 89.85,34.29 R17.2 90.49,34.29 91.44,34.29 92.08,33.66 M6.5
MISO  (via drill 0.35)
  Top 0.152: v27.95,50.54 25.92,52.57 v13,52.57 | v33.81,50.54 IC1.16
  Bottom 0.152: v27.95,50.54 v33.81,50.54 | v13,52.57 12.53,52.57 10.49,54.61 8.89,54.61 JP1.1
N$1
  Top 0.254: M1.1 8.26,24.77 9.21,23.81 C1.1 6.35,18.73 6.35,16.51 | 6.35,16.51 J1.1 | TP21.TP 6.35,16.51
N$2
  Top 0.254: M1.4 12.06,24.77 11.11,23.81 C1.2 8.89,19.37 8.89,16.51 | 8.89,16.51 J1.3 | TP23.TP 8.89,16.51
N$3
  Top 0.203: 22.86,21.27 C3.1
  Top 0.254: J2.1 22.86,16.51 | 22.86,16.51 22.86,21.27 22.86,24.13 22.23,24.77 M2.1 | TP17.TP 22.86,16.51
N$4
  Top 0.203: 25.4,21.27 C3.2
  Top 0.254: J2.3 25.4,16.51 | 25.4,16.51 25.4,21.27 25.4,24.13 26.04,24.77 M2.4 | TP19.TP 25.4,16.51
N$5
  Top 0.152: 39.37,16.51 39.37,15.24
  Top 0.203: 39.37,21.27 C4.1
  Top 0.254: J3.1 39.37,15.24 39.37,21.27 39.37,24.13 38.73,24.77 M3.1 | TP13.TP 39.37,16.51
N$6
  Top 0.203: 41.91,21.27 C4.2
  Top 0.254: J3.3 41.91,16.51 | 41.91,16.51 41.91,21.27 41.91,24.13 42.55,24.77 M3.4 | TP15.TP 41.91,16.51
N$7
  Top 0.203: 55.88,21.27 C5.1
  Top 0.254: J4.1 55.88,16.51 | 55.88,16.51 55.88,21.27 55.88,24.13 55.24,24.77 M4.1 | TP9.TP 55.88,16.51
N$8
  Top 0.203: 58.42,21.27 C5.2
  Top 0.254: J4.3 58.42,16.51 | 58.42,16.51 58.42,21.27 58.42,24.13 59.05,24.77 M4.4 | TP11.TP 58.42,16.51
N$9
  Top 0.152: 72.39,21.27 C6.1 72.39,21.91
  Top 0.254: 72.39,21.27 J5.1 72.39,16.51 TP5.TP | 72.39,21.91 72.39,24.13 71.75,24.77 M5.1
N$10
  Top 0.152: 74.93,21.59 C6.2
  Top 0.254: M5.4 75.56,24.77 74.93,24.13 74.93,21.59 74.93,16.51 | J5.3 74.93,16.51 | TP7.TP 74.93,16.51
N$11  (via drill 0.35)
  Top 0.152: IC1.20 40.24,47.74 v40.2,47.7 | v41.4,46.4 41.05,46.05 C20.2
  Bottom 0.152: v40.2,47.7 41.4,46.5 v41.4,46.4
N$12
  Top 0.152: L1.2 35.24,41.96 33.82,43.38 C8.2 33.58,44.92 33.58,48.09 33.98,48.5 34.79,48.5 35.1,48.18 38.41,48.18 38.64,48.41 IC1.18
N$13
  Top 0.254: TP2.TP J6.2
N$14
  Top 0.152: U$1.GPIO2 83.88,60.74 LED1.A
N$15
  Top 0.203: 88.9,21.27 C9.1 88.9,21.91
  Top 0.254: M6.1 88.27,24.77 88.9,24.13 88.9,21.91 | J6.1 88.9,16.51 | 88.9,16.51 88.9,21.27 | TP1.TP 88.9,16.51
N$16
  Top 0.203: 91.44,21.59 C9.2
  Top 0.254: M6.4 92.08,24.77 91.44,24.13 91.44,21.59 91.44,16.51 | J6.3 91.44,16.51 | TP3.TP 91.44,16.51
N$17
  Top 0.152: LED1.C R24.1
N$18
  Top 0.254: TP4.TP 95.25,16.51 J6.4
N$19
  Top 0.254: TP22.TP J1.2
N$20
  Top 0.254: TP24.TP 12.7,16.51 J1.4
N$21
  Top 0.508: JP3.2 JP1.2
N$22
  Top 0.254: TP18.TP J2.2
N$23
  Top 0.254: TP20.TP 29.21,16.51 J2.4
N$24
  Top 0.254: TP16.TP 45.72,16.51 J3.4
N$25
  Top 0.254: TP14.TP J3.2
N$26
  Top 0.254: TP12.TP 62.23,16.51 J4.4
N$27
  Top 0.254: TP10.TP J4.2
N$28
  Top 0.254: TP8.TP 78.74,16.51 J5.4
N$29
  Top 0.254: TP6.TP J5.2
N$30
  Top 0.508: JP6.2 JP2.2 R27.1
N$31
  Top 0.254: 1WIRE.2 64.77,66.04 66.13,64.68 U$1.GPIO16
N$32
  Top 0.152: LED2.C 63.31,74.28 R28.1
RESET  (via drill 0.35)
  Top 0.152: R16.2 7.3,50.48 JP1.5 6.35,52.07 6.35,54.07 6.89,54.61 30.48,54.61 v31.75,55.88 | IC1.29 43.86,53.74 v43.4,54.2
  Top 0.203: S1.2 7.2,44.69 | S1.1 7.2,44.69 | 7.2,44.69 7.3,44.79 R16.2
  Bottom 0.152: v43.4,54.2 41.72,55.88 v31.75,55.88
RTS  (via drill 0.35)
  Top 0.152: v73.76,70.72 82.18,70.72 83.47,72.01 86.7,72.01 87.27,71.44 R23.2 v88.9,64.77
  Bottom 0.152: v73.76,70.72 69.86,70.72 U$1.RESET | v88.9,64.77 91.44,62.23 JP5.4
RX  (via drill 0.35)
  Top 0.152: IC1.30 53.27,54.54 v53.34,54.61 | v58.42,54.61 66.04,46.99 JP4.1
  Bottom 0.152: v53.34,54.61 v58.42,54.61
SCK  (via drill 0.35)
  Top 0.152: JP1.3 8.26,53.34 9.55,52.05 11.05,52.05 11.34,51.76 25.64,51.76 v27.95,49.45 | v36.57,49.05 IC1.17
  Bottom 0.152: v36.57,49.05 36.17,49.45 v27.95,49.45
SCL  (via drill 0.35)
  Top 0.152: R20.2 JP2.3 JP6.3 53.34,63.5 49.53,59.69 v49.53,58.42 50.3,57.66 59.54,57.66 62.69,54.51 72.29,54.51 82.46,64.68 U$1.GPIO5 | IC1.28 48.64,52.94 v48.7,53
  Bottom 0.152: v48.7,53 49.53,53.83 v49.53,58.42
SDA  (via drill 0.35)
  Top 0.152: IC1.27 49.47,52.14 v49.5,52.17 | R21.2 JP2.4 JP6.4 55.88,64.77 50.8,59.69 50.8,58.45 v50.77,58.42 59.42,58.42 62.92,54.91 72.06,54.91 U$1.GPIO4
  Bottom 0.152: v50.77,58.42 50.77,53.55 49.5,52.28 v49.5,52.17
TX  (via drill 0.35)
  Top 0.152: IC1.31 52.14,55.34 v52.2,55.4 | v59.77,55.3 65.54,49.53 69.85,49.53 | JP4.2 72.39,49.53 | 72.39,49.53 69.85,49.53 | R25.2 69.85,49.53 | R26.1 72.39,49.53
  Bottom 0.152: v52.2,55.4 59.67,55.4 v59.77,55.3
VCC  (via drill 0.35)  (2 unrouted)
  Top 0.152: U$1.CH_PD 71.76,66.68 72.39,67.31 | R20.1 53.34,77.47 | R21.1 55.88,77.47 | R16.1 2.54,46.99 | L1.1 35.24,29.29 34.29,28.34 | C16.2 48.26,77.47 | R25.1 69.85,52.68 v69.8,52.73 | LED2.A 60.96,76.35 60.96,77.47
  Top 0.254: R3.1 R2.1 17.46,29.29 16.51,28.34 | 30.48,28.34 31.43,29.29 R6.1 R5.1 | R14.1 R15.1 80.96,29.29 80.01,28.34 | R8.1 R9.1 47.94,29.29 46.99,28.34 | R11.1 R12.1 64.45,29.29 63.5,28.34 | R18.1 96.02,30.66 R19.1 | IC1.6 39.44,60.59 39.59,60.74 | 39.99,60.66 39.99,59.34 41.04,58.29 IC1.4 | C7.1 64.85,56.68 | 1WIRE.3 64.38,68.58 67.9,72.1 | IC2.4 16.67,74.27 C2.2
  Top 0.508: M6.3 M6.2 89.53,27.7 88.9,28.34 | M5.3 M5.2 73.03,27.7 72.39,28.34 | M4.3 M4.2 56.52,27.7 55.88,28.34 | M3.3 M3.2 40.01,27.7 39.37,28.34 | M2.3 M2.2 23.5,27.7 22.86,28.34 | 17.78,28.34 16.51,28.34 8.89,28.34 | 17.78,28.34 22.86,28.34 | 22.86,28.34 30.48,28.34 34.29,28.34 39.37,28.34 | 39.37,28.34 46.99,28.34 55.88,28.34 | 55.88,28.34 63.5,28.34 72.39,28.34 | 72.39,28.34 80.01,28.34 88.9,28.34 | 8.89,28.34 3.41,28.34 2.54,29.21 2.54,46.99 2.54,60.96 | M1.3 M1.2 9.53,27.7 8.89,28.34 | 2.54,60.96 2.54,68.58 11.43,77.47 12.7,77.47 | 12.7,77.47 39.37,77.47 | 39.37,77.47 48.26,77.47 50.8,77.47 | 50.8,77.47 53.34,77.47 55.88,77.47 60.96,77.47 64.77,77.47 66.04,76.2 66.04,73.66 67.6,72.1 67.9,72.1 72.39,72.1 | 39.37,77.47 39.69,77.15 C10.2 C12.2 | JP3.1 2.54,60.96 | IC2.4 12.7,77.47 | C11.1 62.43,57.6 63.43,56.6 C7.1 | 64.85,56.68 U$1.VCC 70.65,56.68 72.39,58.42 72.39,67.31 72.39,72.1 | R19.1 96.2,30.16 94.38,28.34 88.9,28.34 | 72.39,72.1 82.5,72.1 83.74,73.34 R23.1 90.17,73.34 R22.1 | R27.2 50.8,77.47 | C13.2 17.78,28.34 | C12.2 39.99,60.66 | C12.2 39.69,60.84 39.59,60.74
  Top 0.61: JP3.1 7.62,62.15 8.93,63.46 C19.+
  Bottom 0.152: v69.8,52.73 69.8,56.66 U$1.VCC
VIN
  Top 0.61: IC2.3 20.98,67.97 | 20.98,67.97 27.3,74.3 X1.1 | 20.98,67.97 21.88,67.97 C17.2 C18.2 28.26,66.99 29.67,65.58 J7.3

### Text on the board
tNames: JLCJLCJLCJLC
tDocu: TX / RX